# EAGLE design schema (EAGLE 9.6.2)
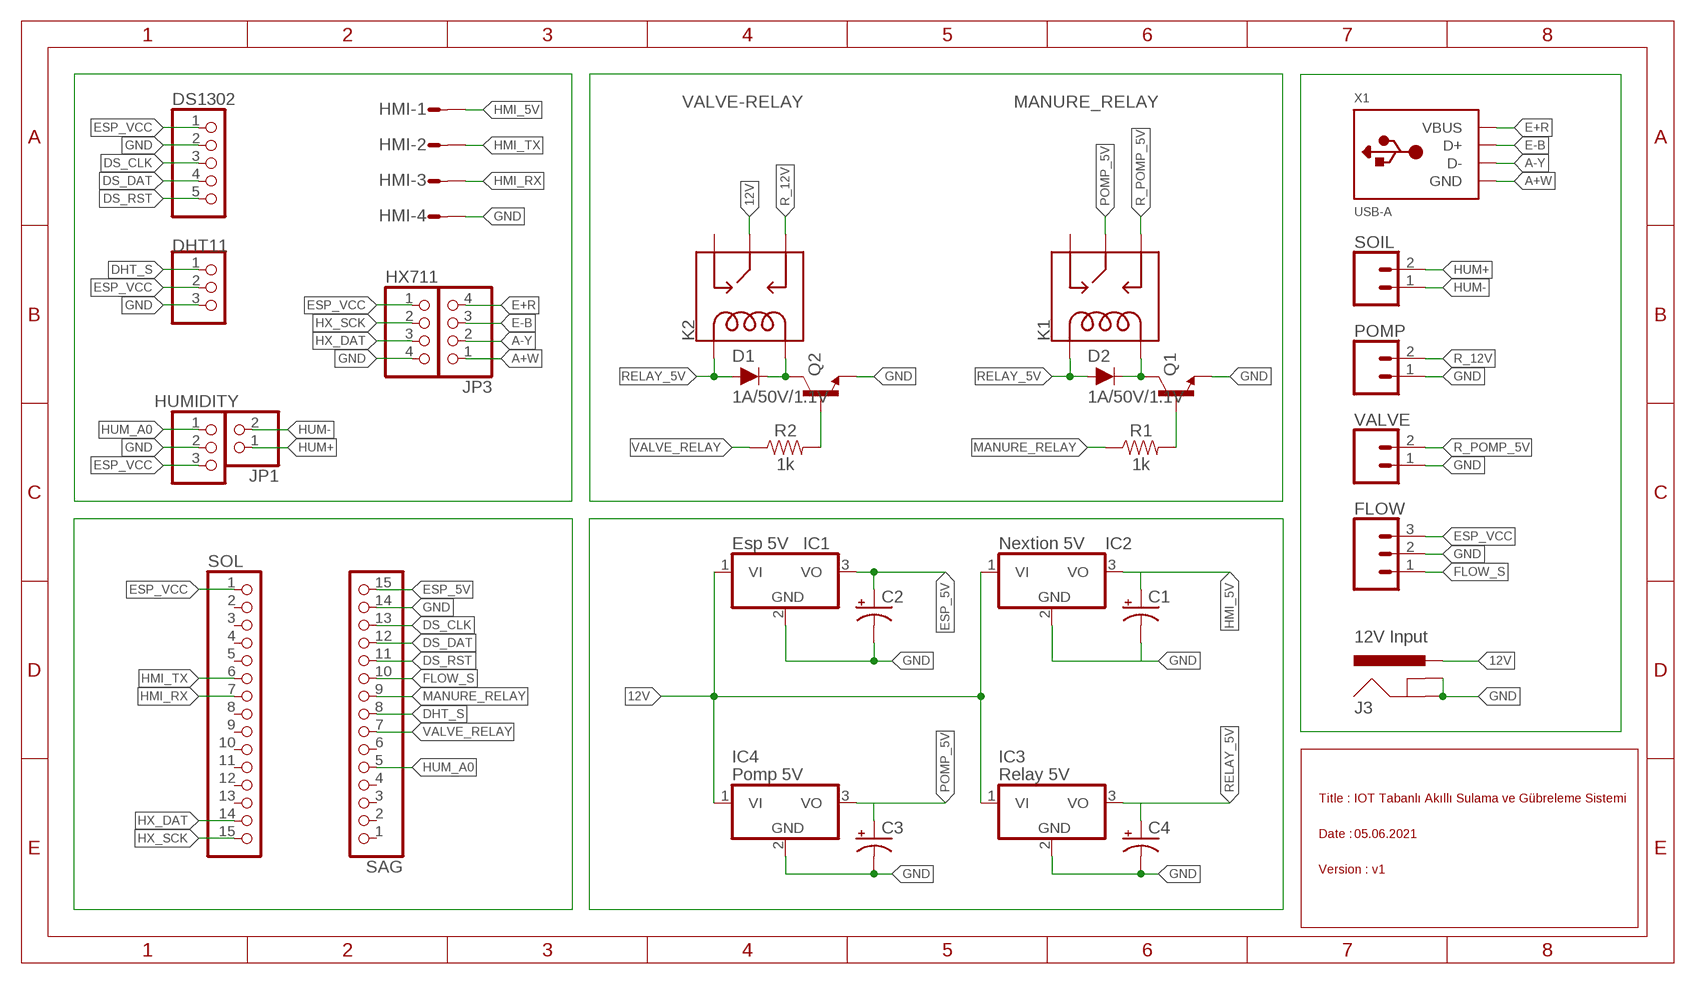
[diagram p0: schematic, sheet 1]

## Parts
C1  CPOL-USE5-5  [E5-5]
C2  CPOL-USE5-5  [E5-5]
C3  CPOL-USE5-5  [E5-5]
C4  CPOL-USE5-5  [E5-5]
D1  1A/50V/1.1V  DIODE-PTH  [DIODE-1N4001]
D2  1A/50V/1.1V  DIODE-PTH  [DIODE-1N4001]
DHT11  DHT11  PINHD-1X3  [1X03]
DS1302  PINHD-1X5  [1X05]
FLOW  CONN_03JST-PTH  [JST-3-PTH]
HMI  L04P  [L04P]
HUMIDITY  PINHD-1X3  [1X03]
HX711  PINHD-1X4  [1X04]
IC1  Esp 5V  7815T  [TO220H]
IC2  Nextion 5V  7815T  [TO220H]
IC3  Relay 5V  7815T  [TO220H]
IC4  Pomp 5V  7815T  [TO220H]
J3  12V Input  POWER_JACKPTH_LOCK  [POWER_JACK_PTH_LOCK]
JP1  PINHD-1X2  [1X02]
JP3  PINHD-1X4  [1X04]
K1  MANURE_RELAY  RELAY-SPDT  [RELAY_G5LE]
K2  VALVE-RELAY  RELAY-SPDT  [RELAY_G5LE]
POMP  CONN_02-JST-2-PTH-NO_SILK  [JST-2-PTH-NS]
Q1  200mA/40V  TRANS_NPN-2N3904  [TO-92]
Q2  200mA/40V  TRANS_NPN-2N3904  [TO-92]
R1  1k  1KOHM-HORIZ-1/4W-1%  [AXIAL-0.3]
R2  1k  1KOHM-HORIZ-1/4W-1%  [AXIAL-0.3]
SAG  PINHD-1X15-CB  [1X15-CB]
SOIL  CONN_02-JST-2-PTH-NO_SILK  [JST-2-PTH-NS]
SOL  PINHD-1X15-CB  [1X15-CB]
VALVE  CONN_02-JST-2-PTH-NO_SILK  [JST-2-PTH-NS]
X1  USB-A  [MOLEX_480371000]

## Nets
12V: IC1.1(VI) IC2.1(VI) IC3.1(VI) IC4.1(VI) J3.PWR K2.1(MAIN)
A+W: JP3.1 X1.4(GND)
A-Y: JP3.2 X1.2(D-)
DHT_S: DHT11.1 SAG.8
DS_CLK: DS1302.3 SAG.13
DS_DAT: DS1302.4 SAG.12
DS_RST: DS1302.5 SAG.11
E+R: JP3.4 X1.1(VBUS)
E-B: JP3.3 X1.3(D+)
ESP_5V: C2.+ IC1.3(VO) SAG.15
ESP_5V1: C1.+
ESP_5V2: C4.+
ESP_5V3: C3.+
ESP_VCC: DHT11.2 DS1302.1 FLOW.3 HUMIDITY.3 HX711.1 SOL.1
FLOW_S: FLOW.1 SAG.10
GND: C2.- C3.- C4.- DHT11.3 DS1302.2 FLOW.2 HMI.4 HUMIDITY.2 HX711.4 IC1.2(GND) IC2.2(GND) IC3.2(GND) IC4.2(GND) J3.GND J3.GNDBREAK POMP.1 Q1.1(E) Q2.1(E) SAG.14 VALVE.1
GND2: C1.-
HMI_5V: HMI.1 IC2.3(VO)
HMI_RX: HMI.3 SOL.7
HMI_TX: HMI.2 SOL.6
HUM+: JP1.1 SOIL.2
HUM-: JP1.2 SOIL.1
HUM_A0: HUMIDITY.1 SAG.5
HX_DAT: HX711.3 SOL.14
HX_SCK: HX711.2 SOL.15
MANURE_RELAY: R1.P$1 SAG.9
N$4: D2.C K1.5(COIL2) Q1.3(C)
N$5: Q1.2(B) R1.P$2
N$6: D1.C K2.5(COIL2) Q2.3(C)
N$7: Q2.2(B) R2.P$2
POMP_5V: IC4.3(VO) K1.1(MAIN)
R_12V: K2.3(NO) POMP.2
R_POMP_5V: K1.3(NO) VALVE.2
RELAY_5V: D1.A D2.A IC3.3(VO) K1.2(COIL1) K2.2(COIL1)
VALVE_RELAY: R2.P$1 SAG.7
Unconnected: K1.4(NC) K2.4(NC) SAG.1 SAG.2 SAG.3 SAG.4 SAG.6 SOL.2 SOL.3 SOL.4 SOL.5 SOL.8 SOL.9 SOL.10 SOL.11 SOL.12 SOL.13

## Notes on the sheet
- Title : | IOT Tabanlı Akıllı Sulama ve Gübreleme Sistemi
- Date : | 05.06.2021
- Version : | v1

## Library data of the parts
C1-C4 = adafruit:CPOL-US: POLARIZED CAPACITOR, American symbol
D1 D2 = SparkFun-DiscreteSemi:DIODE: Diode These are standard reverse protection diodes and small signal diodes. SparkFun Products: SparkFun SparkPunk Sound Kit <https://www.sparkfun.com/products/11177> SparkFun ESP8266 Thing <https://www.sparkfun.com/products/13231>; PROD_ID: DIO-09176
DHT11 HUMIDITY = adafruit:PINHD-1X3: PIN HEADER
DS1302 = pinhead:PINHD-1X5: PIN HEADER
FLOW = SparkFun-Connectors:CONN_03: Multi connection point. Often used as Generic Header-pin footprint for 0.1 inch spaced/style header connections On any of the 0.1 inch spaced packages, you can populate with these: Break Away Headers - Straight <https://www.sparkfun.com/products/116> (PRT-00116) Break Away Male Headers - Right Angle <https://www.sparkfun.com/products/553> (PRT-00553) Female Headers <https://www.sparkfun.com/products/115> (PRT-00115) Break Away Headers - Machine Pin <https://www.sparkfun.com/products/117> (PRT-00117) Break Away Female Headers - Swiss Machine Pin <https://www.sparkfun.com/products/743> (PRT-00743) Stackable Header - 3 Pin (Female, 0.1") <https://www.sparkfun.com/products/13875> (PRT-13875) For SCREWTERMINALS and SPRING TERMINALS visit here: Screw Terimnals on SparkFun.com <https://www.sparkfun.com/search/results?term=Screw+Terminals> (5mm/3.5mm/2.54mm spacing) This device is also useful as a general connection point to wire up your design to another part of your project. Our various solder wires solder well into these plated through hole pads. Hook-Up Wire - Assortment (Stranded, 22 AWG) <https://www.sparkfun.com/products/11375> (PRT-11375) Hook-Up Wire - Assortment (Solid Core, 22 AWG) <https://www.sparkfun.com/products/11367> (PRT-11367) View the entire wire category on our website here <https://www.sparkfun.com/categories/141> Special notes: Molex polarized connector foot print use with SKU : PRT-08232 with associated crimp pins and housings.; PROD_ID: WIRE-10037; SF_ID: PRT-09915
HMI = con-amp-mt:L04P: AMP MT CONNECTOR; OC_FARNELL: unknown; OC_NEWARK: unknown
HX711 JP3 = pinhead:PINHD-1X4: PIN HEADER
IC1-IC4 = linear:78*: Positive VOLTAGE REGULATOR Source: http://cache.national.com/ds/LM/LM78L05.pdf http://www.fairchildsemi.com/ds/LM/LM7805.pdf
J3 = SparkFun-Connectors:POWER_JACK: Power Jack Connector This is the standard 5.5mm barrel jack for power. The PTH is the most common, proven, reliable, footprint. The Slot footprint only works if the mill layer is transmitted to the PCB fab house so be warned. Here are the connectors we sell at SparkFun: DC Barrel Power Jack/Connector <https://www.sparkfun.com/products/119> (PRT-00119) DC Barrel Power Jack/Connector (SMD) <https://www.sparkfun.com/products/12748> (PRT-12748) DC Barrel Jack Adapter - Breadboard Compatible <https://www.sparkfun.com/products/10811> (PRT-10811) It is used on this SparkFun product (and many, many others): SparkFun RedBoard - Programmed with Arduino <https://www.sparkfun.com/products/12757> (DEV-12757) Also, if you need a mating power supply or connector, please check these out: Wall Adapter Power Supply - 9VDC 650mA <https://www.sparkfun.com/products/298> (TOL-00298) DC Barrel Jack Adapter - Male <https://www.sparkfun.com/products/10287> (PRT-10287); PROD_ID: CONN-08197; SF_ID: PRT-00119
JP1 = pinhead:PINHD-1X2: PIN HEADER
K1 K2 = SparkFun-Electromechanical:RELAY-SPDT: SPDT Electromechanical Relay Single-pole, double-throw sealed relays. When current is applied to the coil, it throws a simple changeover switch, terminating the connection from the NC contact to ground and closing the NO contact. Use them to switch high voltage/high current devices. SparkFun Products JQX-15F: Relay SPDT Sealed - 20A <https://www.sparkfun.com/products/10924> (COM-10924) JZC-11F: Relay SPDT Sealed <https://www.sparkfun.com/products/100> (COM-00100); PROD_ID: COMP-14214
POMP SOIL VALVE = SparkFun-Connectors:CONN_02: Multi connection point. Often used as Generic Header-pin footprint for 0.1 inch spaced/style header connections On any of the 0.1 inch spaced packages, you can populate with these: Break Away Headers - Straight <https://www.sparkfun.com/products/116> (PRT-00116) Break Away Male Headers - Right Angle <https://www.sparkfun.com/products/553> (PRT-00553) Female Headers <https://www.sparkfun.com/products/115> (PRT-00115) Break Away Headers - Machine Pin <https://www.sparkfun.com/products/117> (PRT-00117) Break Away Female Headers - Swiss Machine Pin <https://www.sparkfun.com/products/743> (PRT-00743) For SCREWTERMINALS and SPRING TERMINALS visit here: Screw Terimnals on SparkFun.com <https://www.sparkfun.com/search/results?term=Screw+Terminals> (5mm/3.5mm/2.54mm spacing) This device is also useful as a general connection point to wire up your design to another part of your project. Our various solder wires solder well into these plated through hole pads. Hook-Up Wire - Assortment (Stranded, 22 AWG) <https://www.sparkfun.com/products/11375> (PRT-11375) Hook-Up Wire - Assortment (Solid Core, 22 AWG) <https://www.sparkfun.com/products/11367> (PRT-11367) View the entire wire category on our website here <https://www.sparkfun.com/categories/141> Special notes: Molex polarized connector foot print use with: PRT-08233 with associated crimp pins and housings. 2.54_SCREWTERM for use with PRT-10571. 3.5mm Screw Terminal footprints for PRT-08084 5mm Screw Terminal footprints for use with PRT-08432
Q1 Q2 = SparkFun-DiscreteSemi:TRANS_NPN: NPN transistor Current controlled devices typically used to amplify current or used as a switch. BC547 - COM-08928 <http://www.sparkfun.com/products/8928> (TO-92 45V 100mA) (1.Collector 2.Base 3.Emitter) 2N3904 - COM-00521 <http://www.sparkfun.com/products/521> (TO-92 40V 200mA) (1.Emitter 2.Base 3.Collector) P2N2222A - COM-12852 <http://www.sparkfun.com/products/12852> (TO-92 40V 600mA) (1.Collector 2.Base 3.Emitter); PROD_ID: TRANS-08447
R1 R2 = SparkFun-Resistors:1KOHM: 1kΩ resistor A resistor is a passive two-terminal electrical component that implements electrical resistance as a circuit element. Resistors act to reduce current flow, and, at the same time, act to lower voltage levels within circuits. - Wikipedia; PROD_ID: RES-12182
SAG SOL = adafruit:PINHD-1X15: PIN HEADER
X1 = adafruit:USB-A: USB type A 'plug' Used for things that can directly connect to a USB port, say USB key

## Board
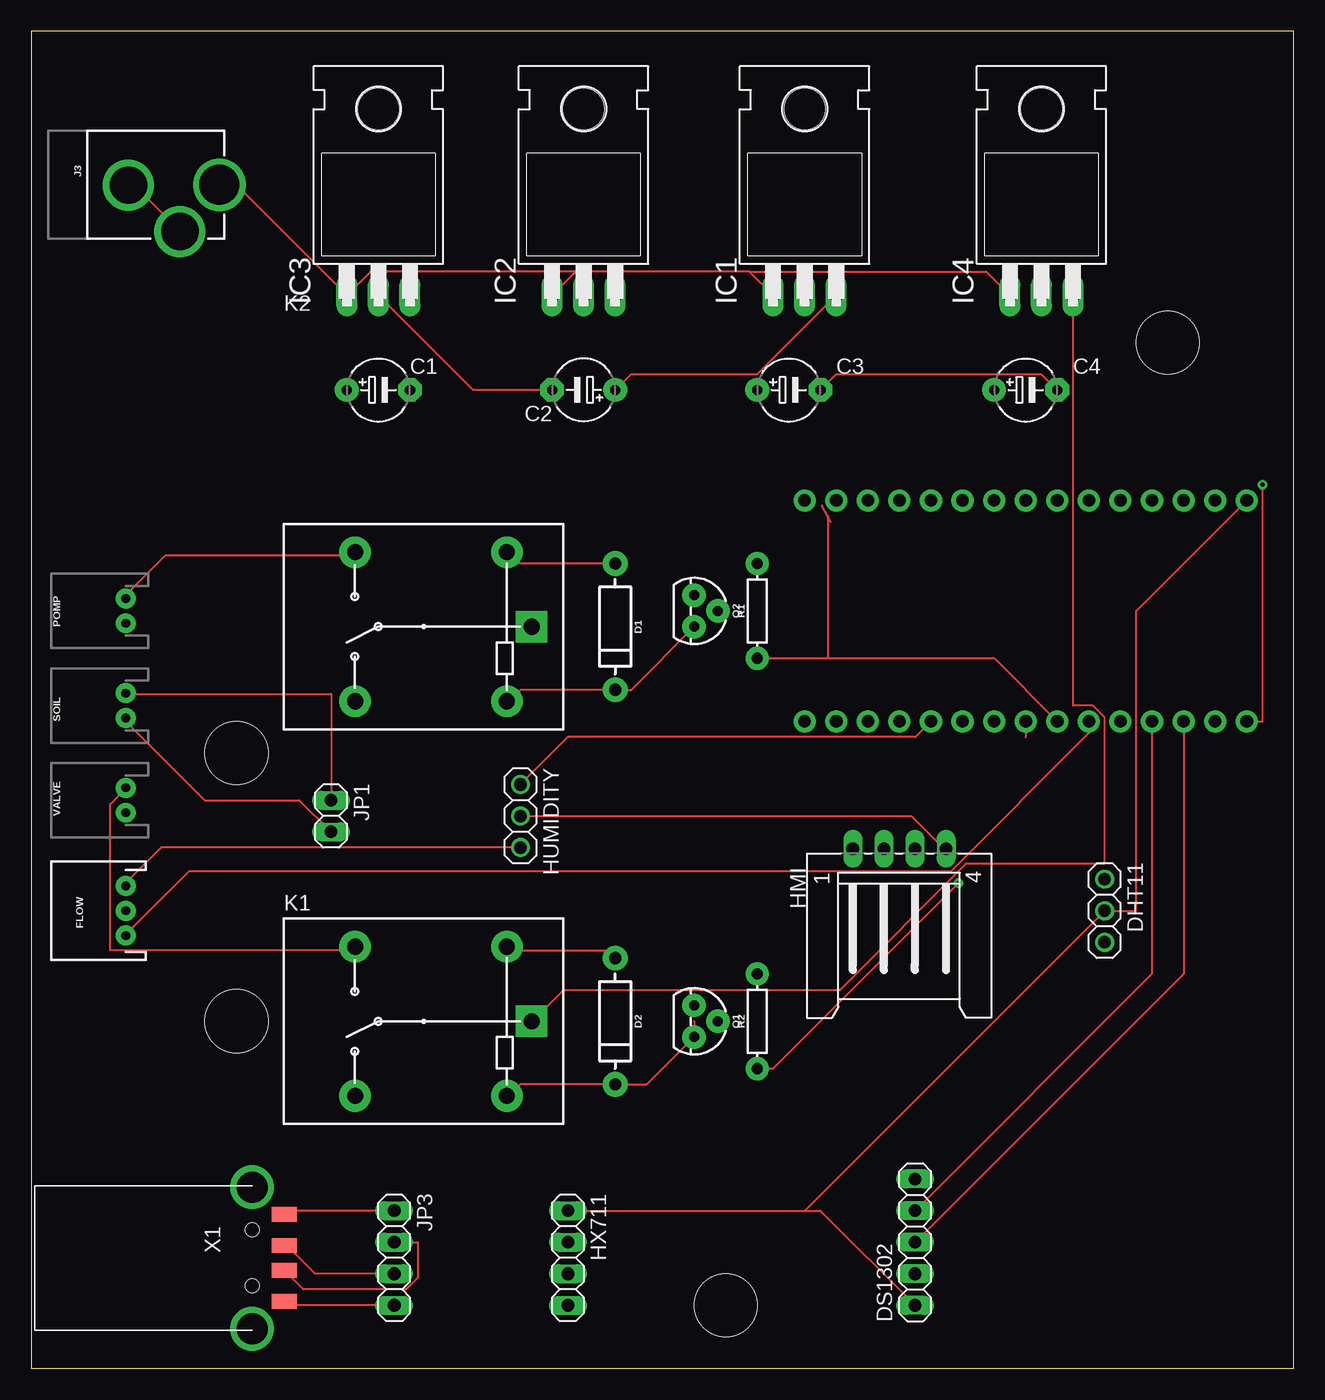
[diagram p1: board, top side]
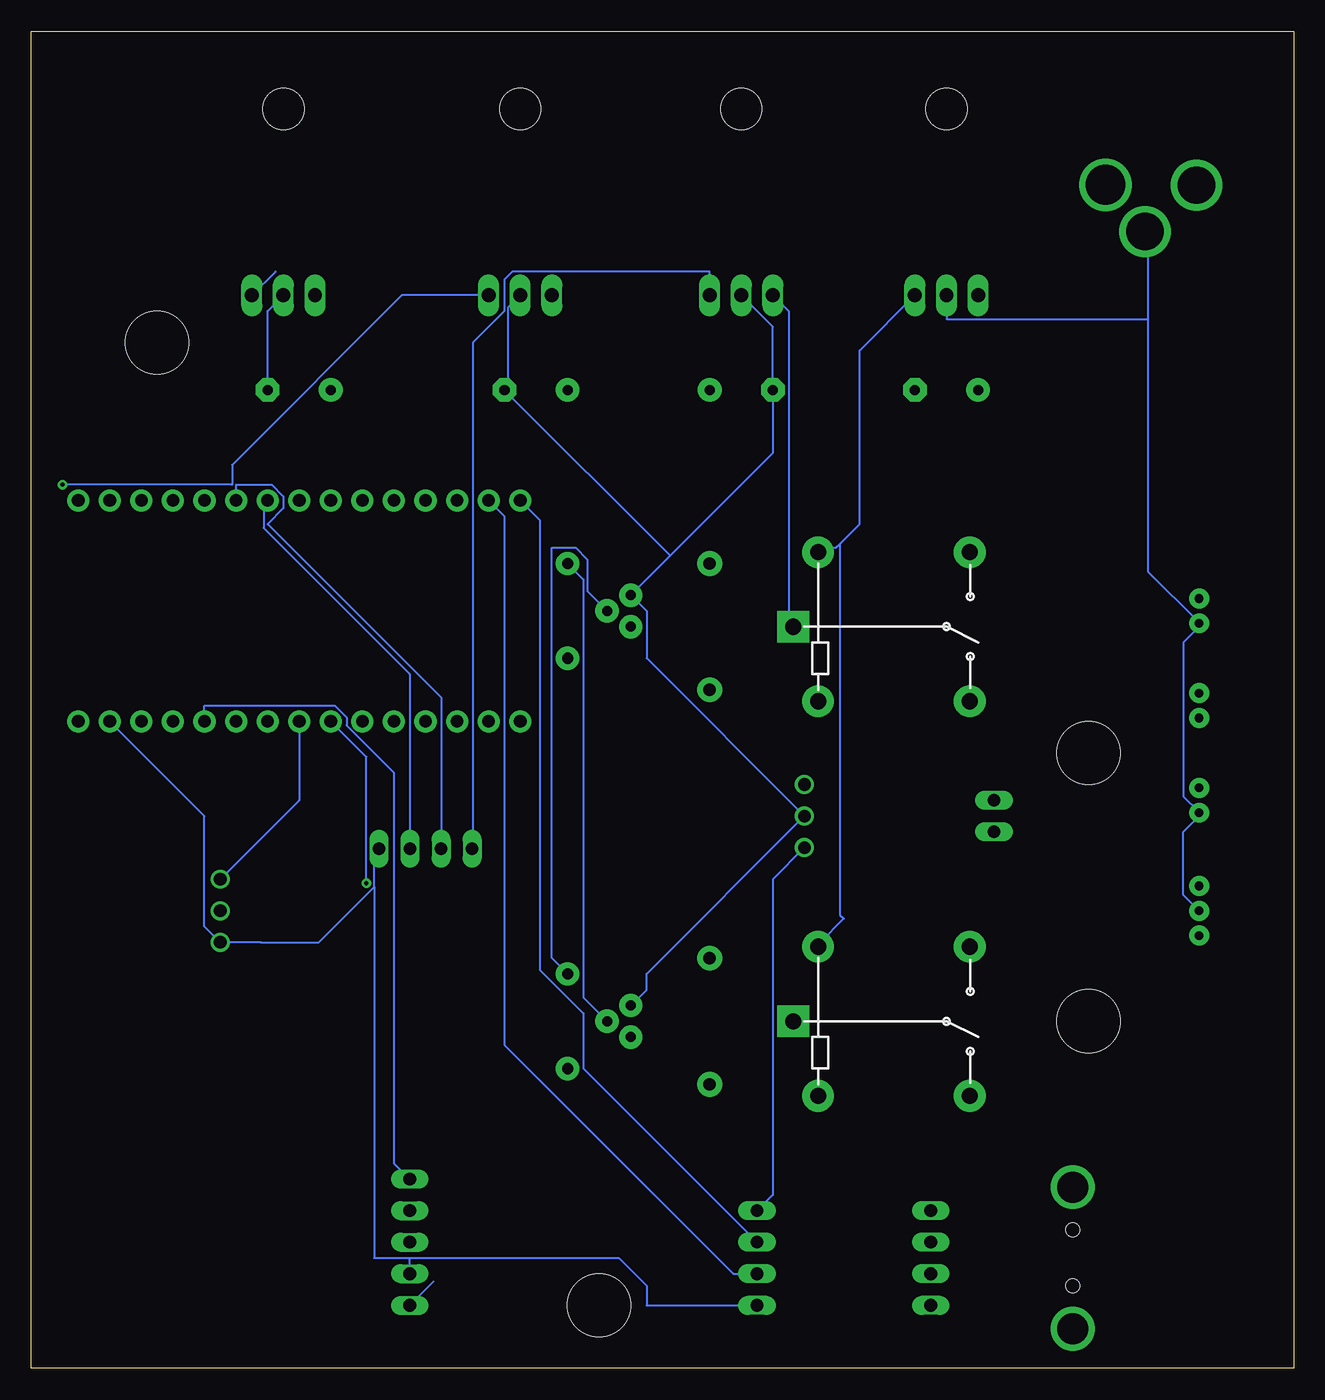
[diagram p2: board, bottom side, seen from below]

Size 101.58 x 107.62 mm. Coordinates in mm from the lower left corner, seen from the top.
Outline: 0,0 101.58,0 101.58,107.62 0,107.62 0,0
Copper layers (1*16): Top 0.035mm / dielectric 1.5mm / Bottom 0.035mm
Design rules "default": minimum track width 6mil, minimum drill 0.35mm, track to track 6mil, track to pad 6mil, pad to pad 6mil, via to via 6mil, smd to smd 6mil, copper to edge 40mil, drill to drill 6mil, minimum pad ring 10mil, minimum via ring 8mil, stop-mask expansion 4mil, vias tented up to drill 0mil, thermal gap 10mil
Holes 5.08 mm at 16.51,49.53 16.51,27.94 55.88,5.08 91.44,82.55

### Footprints (pad centres in the part's own frame; a part is rotated, then mirrored left to right if it is on the bottom)
E5-5 = drill 0.813 pad 1.905: + -2.54,0 | drill 0.813 pad 1.905 octagon: - 2.54,0
DIODE-1N4001 = drill 1 pad 1.981: A -5.08,0; C 5.08,0
1X03 = drill 1.016: 1 -2.54,0; 2 0,0; 3 2.54,0
1X05 = drill 1.016 long: 1 -5.08,0; 2 -2.54,0; 3 0,0; 4 2.54,0; 5 5.08,0
JST-3-PTH = drill 0.7 pad 1.6: 1 -2,0; 2 0,0; 3 2,0
L04P = drill 1.016 long: 1 3.75,-6.25; 2 1.25,-6.25; 3 -1.25,-6.25; 4 -3.75,-6.25
1X04 = drill 1.016 long: 1 -3.81,0; 2 -1.27,0; 3 1.27,0; 4 3.81,0
TO220H = drill 1.118 long: 1 -2.54,-10.16; 2 0,-10.16; 3 2.54,-10.16 | hole 3.302: 0,4.826
POWER_JACK_PTH_LOCK = drill 2.997 pad 4.115: GND 0.025,6.557; GNDBREAK 3.762,10.7 | drill 3.2 pad 4.115: PWR 0,13.878
1X02 = drill 1.016 long: 1 -1.27,0; 2 1.27,0
RELAY_G5LE = drill 1.3 pad 2.54 square: 1 8.52,-0.005 | drill 1.3 pad 2.54: 2 6.52,5.995; 3 -5.68,5.995; 4 -5.68,-6.005; 5 6.52,-6.005
JST-2-PTH-NS = drill 0.7 pad 1.6: 1 -1,0; 2 1,0
TO-92 = drill 0.813 pad 1.88: 1 -1.27,0; 2 0,1.905; 3 1.27,0
AXIAL-0.3 = drill 0.9 pad 1.88: P$1 -3.81,0; P$2 3.81,0
1X15-CB = drill 1.016 pad 1.778: 1 -17.78,0; 2 -15.24,0; 3 -12.7,0; 4 -10.16,0; 5 -7.62,0; 6 -5.08,0; 7 -2.54,0; 8 0,0; 9 2.54,0; 10 5.08,0; 11 7.62,0; 12 10.16,0; 13 12.7,0; 14 15.24,0; 15 17.78,0
MOLEX_480371000 = smd 1.2 x 2: 1 3.5,2.6; 2 1,2.6; 3 -1,2.6; 4 -3.5,2.6 | drill 2.5: M1 -5.7,0; M2 5.7,0 | hole 1.1: -2.25,0; 2.25,0

### Placement (x,y rotation side)
C1  27.94,78.74 0 top
C2  44.45,78.74 180 top
C3  60.96,78.74 0 top
C4  80.01,78.74 0 top
D1  46.99,59.69 270 top
D2  46.99,27.94 270 top
DHT11  86.36,36.83 270 top
DS1302  71.12,10.16 90 top
FLOW  7.62,36.83 90 top
HMI  69.85,35.56 180 top
HUMIDITY  39.37,44.45 270 top
HX711  43.18,8.89 270 top
IC1  62.23,96.52 0 top
IC2  44.45,96.52 0 top
IC3  27.94,96.52 0 top
IC4  81.28,96.52 0 top
J3  1.27,95.25 270 top
JP1  24.13,44.45 270 top
JP3  29.21,8.89 270 top
K1  31.75,27.94 0 top
K2  31.75,59.69 0 top
POMP  7.62,60.96 90 top
Q1  53.34,27.94 270 top
Q2  53.34,60.96 270 top
R1  58.42,60.96 90 top
R2  58.42,27.94 90 top
SAG  80.01,52.07 0 top
SOIL  7.62,53.34 90 top
SOL  80.01,69.85 180 top
VALVE  7.62,45.72 90 top
X1  17.78,8.89 270 top

### Tracks (layer width: path | path; a pad name or v marks a point on that pad's centre or on a via)
12V
  Top 0.152: 57.78,88.27 IC1.1 | J3.PWR 16.51,95.25 IC3.1 27.3,88.27 43.81,88.27 | 43.81,88.27 IC2.1 | 57.78,88.27 43.81,88.27 | IC4.1 76.83,88.27 57.78,88.27
  Bottom 0.152: IC2.1 40.64,85.09 40.64,59.69 K2.1
A+W
  Top 0.152: JP3.1 20.64,12.7 X1.4
A-Y
  Top 0.152: JP3.2 31.11,10.16 31.11,7.3 30.16,6.35 21.91,6.35 20.64,7.62 X1.2
DHT_S
  Top 0.152: SAG.8 80.01,50.8
  Bottom 0.152: DHT11.1 80.01,45.72 SAG.8
DS_CLK
  Top 0.152: DS1302.3 92.71,31.75 SAG.13
DS_DAT
  Top 0.152: DS1302.4 90.17,31.75 SAG.12
DS_RST
  Bottom 0.152: DS1302.5 72.39,16.51 72.39,47.94 76.2,51.75 76.2,52.39 77.15,53.34 87.63,53.34 SAG.11
E+R
  Top 0.152: JP3.4 20.64,5.08 X1.1
E-B
  Top 0.152: JP3.3 22.86,7.62 20.64,9.84 X1.3
ESP_5V  (via drill 0.35)
  Top 0.152: v99.06,71.12 99.06,52.07 SAG.15 | IC1.3 58.42,80.01 48.26,80.01 C2.+
  Bottom 0.152: v99.06,71.12 85.41,71.12 85.41,72.71 71.75,86.36 IC1.3
ESP_VCC
  Top 0.152: DS1302.1 63.5,12.7 62.23,12.7 | HX711.1 62.23,12.7 | 62.23,12.7 DHT11.2 88.9,36.83 88.9,60.96 SOL.1 | HUMIDITY.3 10.48,41.91 7.62,39.05 FLOW.3
  Bottom 0.152: 69.22,6.99 DS1302.1 | HX711.1 41.91,13.97 41.91,39.37 HUMIDITY.3
FLOW_S
  Top 0.152: SAG.10 85.09,51.12 73.98,40.01 12.7,40.01 7.62,34.92 FLOW.1
GND
  Top 0.152: 7.62,60.33 POMP.1 | J3.GNDBREAK 11.75,91.76 8.57,94.93 7.94,94.93 J3.GND | IC3.2 35.56,78.74 C2.- | C4.- 81.28,80.01 64.77,80.01 C3.- | HUMIDITY.2 70.8,44.45 73.34,41.91 HMI.4
  Bottom 0.152: Q1.1 52.07,30.48 52.07,31.75 HUMIDITY.2 52.07,57.15 52.07,60.96 Q2.1 50.16,65.41 | HX711.4 52.07,5.08 52.07,6.67 54.29,8.89 71.12,8.89 | DS1302.2 71.12,8.89 | 73.98,38.73 73.98,41.27 73.66,41.59 HMI.4 | 73.98,38.73 78.42,34.29 83.09,34.29 83.19,34.29 DHT11.3 87.63,35.56 87.63,44.45 SAG.14 | 71.12,8.89 73.98,8.89 73.98,38.73 | FLOW.2 8.89,38.1 8.89,43.18 7.62,44.45 VALVE.1 7.62,44.77 8.89,46.04 8.89,58.42 7.62,59.69 POMP.1 7.62,60.01 11.75,64.14 11.75,84.45 | 11.75,84.45 11.75,91.44 J3.GNDBREAK | IC4.2 82.55,85.09 C4.- | IC1.2 63.18,85.41 63.18,79.06 C3.- 50.16,65.41 | IC2.2 41.91,83.82 C2.- 41.91,73.66 50.16,65.41 | 11.75,84.45 27.94,84.45 IC3.2
HMI_5V
  Bottom 0.152: IC2.3 46.99,88.27 62.87,88.27 63.5,87.63 63.5,85.09 66.04,82.55 66.04,41.91 HMI.1
HMI_RX
  Bottom 0.152: SOL.7 82.87,69.53 82.87,67.63 71.12,55.88 71.12,41.91 HMI.3
HMI_TX
  Bottom 0.152: SOL.6 85.09,71.12 82.23,71.12 81.28,70.17 81.28,69.22 82.55,67.94 68.58,53.98 68.58,41.91 HMI.2
HUM+
  Top 0.152: 24.82,45.03 JP1.1 24.13,54.29 7.62,54.29 SOIL.2 7.62,54.61
HUM-
  Top 0.152: 7.62,52.7 SOIL.1 7.62,52.07 13.97,45.72 21.59,45.72 JP1.2
HUM_A0
  Top 0.152: HUMIDITY.1 43.18,50.8 71.12,50.8 SAG.5
HX_DAT
  Bottom 0.152: HX711.3 45.09,7.62 63.5,26.04 63.5,68.58 SOL.14
HX_SCK
  Bottom 0.152: HX711.2 57.15,24.13 57.15,28.57 60.64,32.07 60.64,68.26 SOL.15
MANURE_RELAY
  Top 0.152: 64.32,68.13 64.09,68.56 | 64.09,68.56 63.62,69.45 | 64.14,57.15 64.14,68.58 64.09,68.56 | R1.P$1 64.14,57.15 | SAG.9 77.47,57.15 64.14,57.15
N$4
  Top 0.152: 53.34,27.94 Q1.3 49.53,22.86 D2.C 39.37,22.86 38.73,22.23 K1.5
N$5
  Bottom 0.152: R1.P$2 57.15,63.5 57.15,29.84 Q1.2
N$6
  Top 0.152: Q2.3 48.26,54.61 D1.C 39.37,54.61 38.73,53.98 K2.5
N$7
  Bottom 0.152: R2.P$2 59.69,33.02 59.69,66.04 57.78,66.04 56.83,65.09 56.83,62.55 Q2.2
POMP_5V
  Top 0.152: IC4.3 83.82,53.34 85.41,53.34 86.36,52.39 86.36,40.64 75.25,40.64 65.09,30.48 42.86,30.48 40.32,27.94 K1.1
  Bottom 0.152: 81.92,88.27 IC4.3
R_12V
  Top 0.152: POMP.2 7.62,62.23 10.79,65.41 26.04,65.41 K2.3
R_POMP_5V
  Top 0.152: VALVE.2 7.62,46.67 6.35,45.4 6.35,33.66 26.04,33.66 K1.3
  Bottom 0.152: 26.04,34.29 K1.3
RELAY_5V
  Top 0.152: D2.A 46.35,33.66 38.42,33.66 K1.2 | D1.A 39.05,64.77 38.42,65.41 K2.2
  Bottom 0.152: 36.51,66.36 36.83,66.04 38.1,66.04 K2.2 | 36.51,66.36 34.92,67.94 34.92,81.92 IC3.3 | K1.2 38.1,34.29 36.2,36.2 36.51,36.51 36.51,66.36
VALVE_RELAY  (via drill 0.35)
  Top 0.152: v74.61,39.05 59.69,24.13 R2.P$1
  Bottom 0.152: SAG.7 74.61,49.21 v74.61,39.05